# EAGLE schematic sensor_schematic (EAGLE 8.0.0)
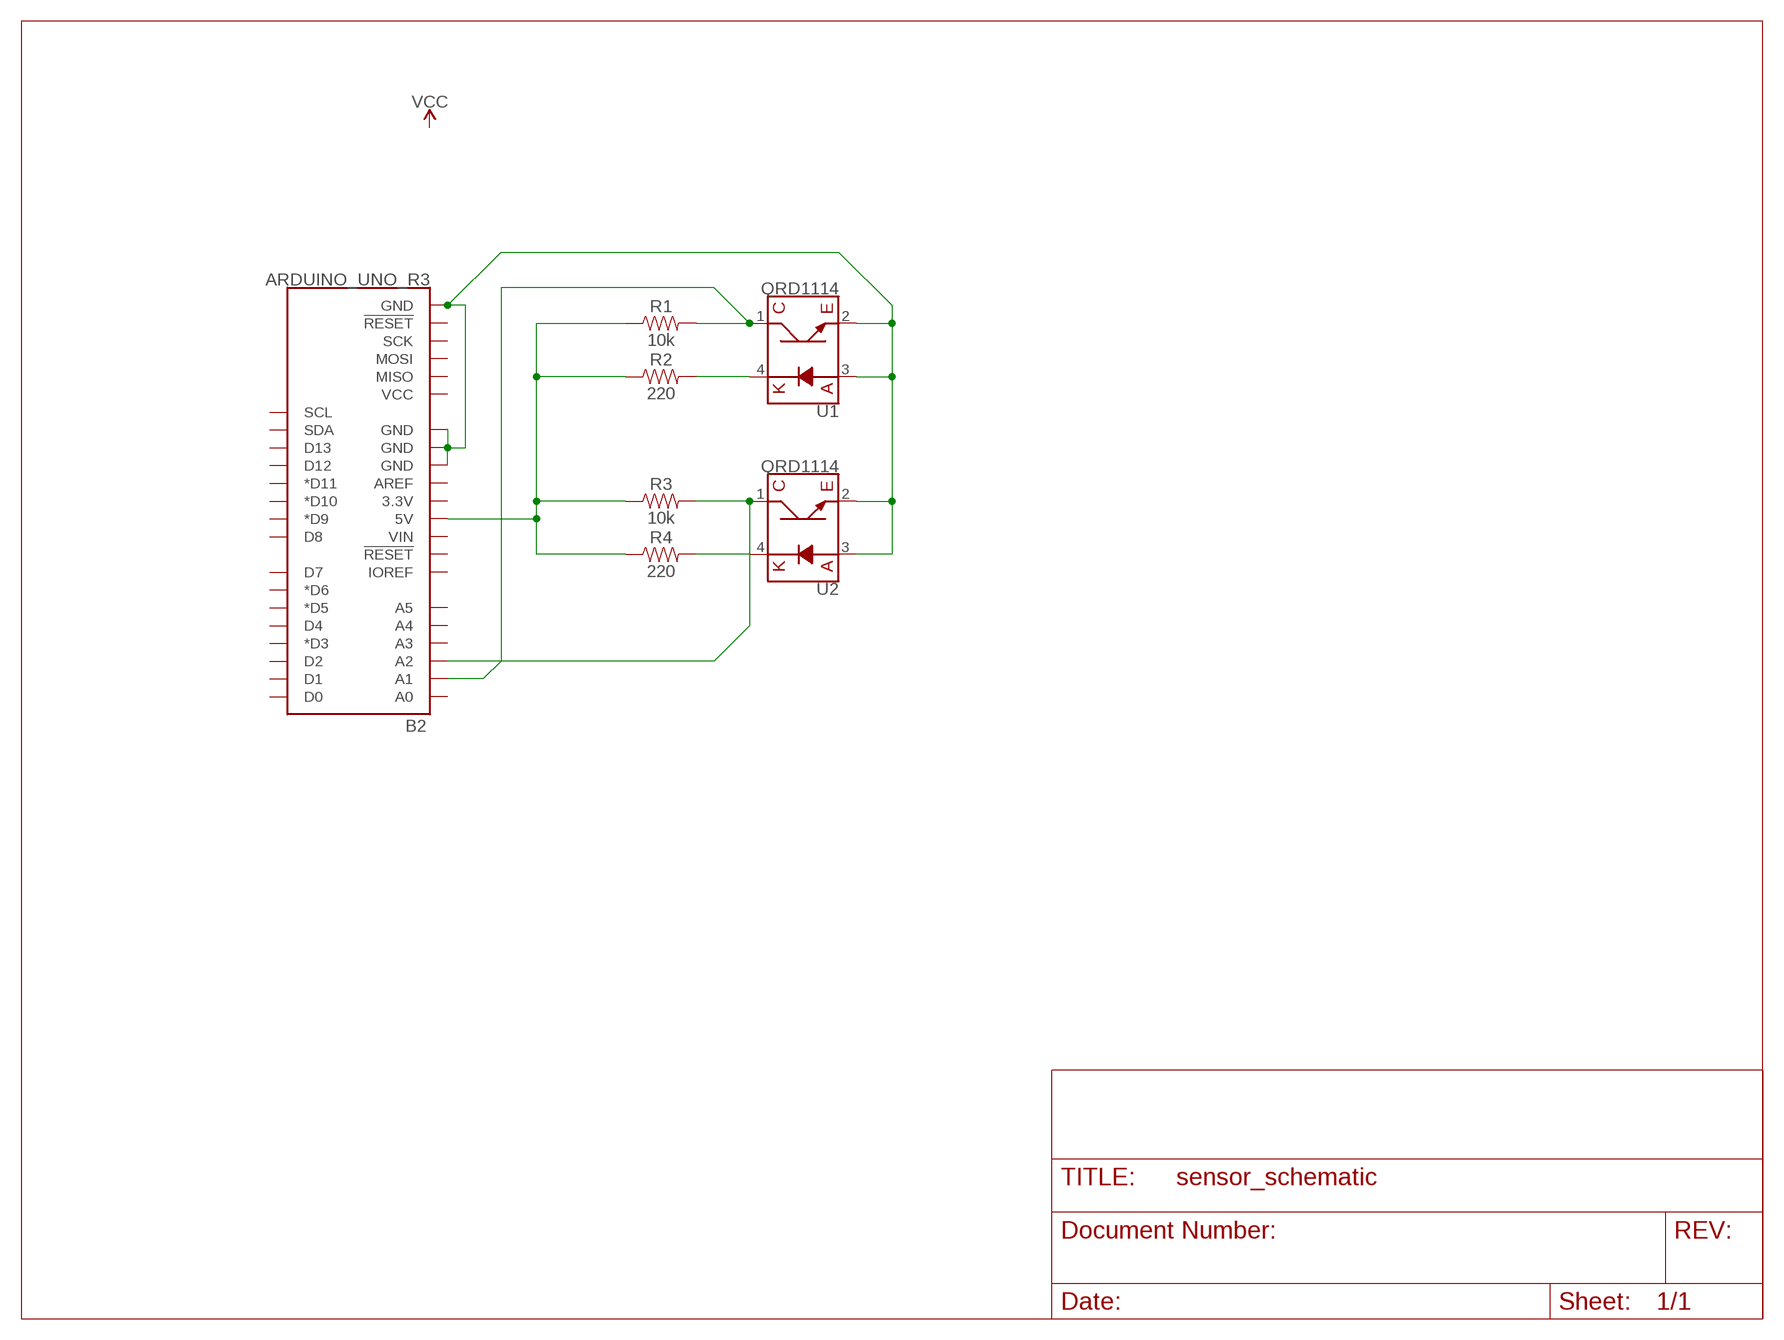
[diagram p0: schematic, sheet 1]

## Parts
B2  ARDUINO_UNO_R3  [ARDUINO_R3]
R1  10k  1KOHM-HORIZ-1/4W-1%  [AXIAL-0.3]
R2  220  1KOHM-HORIZ-1/4W-1%  [AXIAL-0.3]
R3  10k  1KOHM-HORIZ-1/4W-1%  [AXIAL-0.3]
R4  220  1KOHM-HORIZ-1/4W-1%  [AXIAL-0.3]
U1  QRD1114  [QRD1114]
U2  QRD1114  [QRD1114]

## Nets
N$1: B2.5V R1.P$1 R2.P$1 R3.P$1 R4.P$1
N$2: B2.GND@1(GND) B2.GND@2(GND) B2.GND@3(GND) B2.GND@4(GND) U1.2(E) U1.3(A) U2.2(E) U2.3(A)
N$3: B2.A1 R1.P$2 U1.1(C)
N$4: R2.P$2 U1.4(K)
N$5: B2.A2 R3.P$2 U2.1(C)
N$6: R4.P$2 U2.4(K)
Unconnected: B2.3.3V B2.A0 B2.A3 B2.A4 B2.A5 B2.AREF B2.D0 B2.D1 B2.D2 B2.D3(*D3) B2.D4 B2.D5(*D5) B2.D6(*D6) B2.D7 B2.D8 B2.D9(*D9) B2.D10(*D10) B2.D11(*D11) B2.D12 B2.D13 B2.IOREF B2.MISO B2.MOSI B2.RESET@1(!RESET!) B2.RESET@2(!RESET!) B2.SCK B2.SCL B2.SDA B2.VCC B2.VIN

## Library data of the parts
B2 = SparkFun-Boards:ARDUINO_UNO_R3: Arduino R3 Footprint with SPI header Arduino Uno R3 Compatible Footprint. Matches PCB size of the original board. SparkFun Products: SAMD21 Dev Breakout <https://www.sparkfun.com/products/13672> RedBoard <https://www.sparkfun.com/products/12757> R3 Stackable Headers <https://www.sparkfun.com/products/11417>
R1-R4 = SparkFun-Resistors:1KOHM: 1kΩ resistor A resistor is a passive two-terminal electrical component that implements electrical resistance as a circuit element. Resistors act to reduce current flow, and, at the same time, act to lower voltage levels within circuits. - Wikipedia; PROD_ID: RES-12182; VALUE: 1k
U1 U2 = SparkFun-Sensors:QRD1114: QRD1114 Reflective Proximity, Object Sensor This sensor uses an infrared emitted diode combined with an infrared phototransistor to detect the reflected infrared signal. Ideal for sensing black-to-white transitions or can be used to detect nearby objects (.5-1cm). Datasheet <http://www.sparkfun.com/datasheets/BOT/QRD1114.pdf> SparkFun Products Optical Detector / Phototransistor - QRD1114 <https://www.sparkfun.com/products/246> (SEN-00246); PROD_ID: IC-09032; SF_ID: SEN-00246